# EAGLE design SparkFun_Digi_XBee_Arduino_Shield_Qwiic (EAGLE 9.6.2)
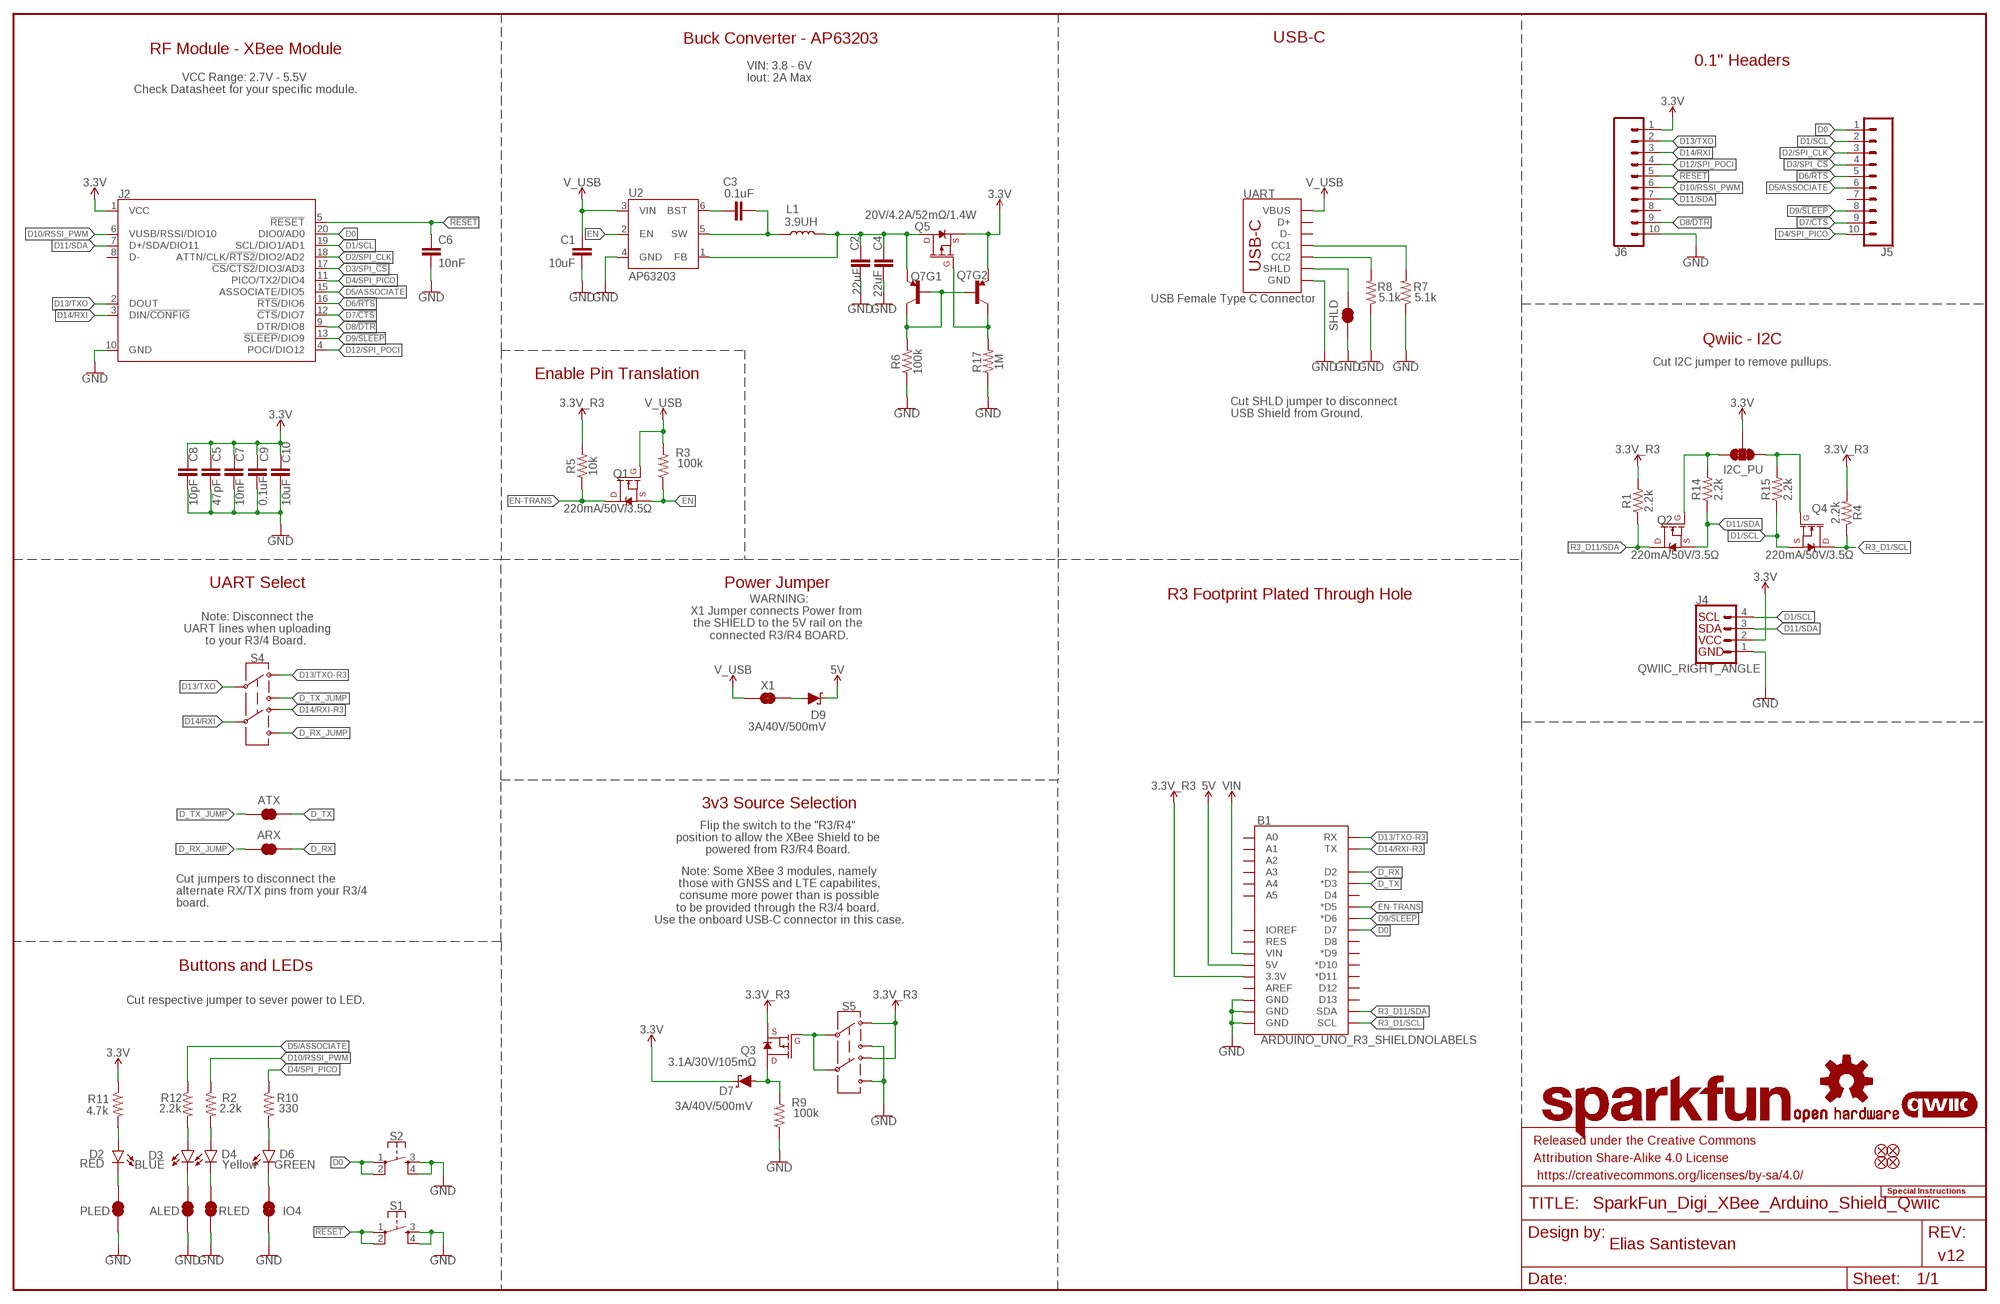
[diagram p0: schematic, sheet 1]

## Parts
ALED  JUMPER-SMT_2_NC_TRACE_SILK  [SMT-JUMPER_2_NC_TRACE_SILK]
ARX  JUMPER-SMT_2_NC_TRACE_SILK  [SMT-JUMPER_2_NC_TRACE_SILK]
ATX  JUMPER-SMT_2_NC_TRACE_SILK  [SMT-JUMPER_2_NC_TRACE_SILK]
B1  ARDUINO_UNO_R3_SHIELDNOLABELS  [UNO_R3_SHIELD_NOLABELS]
C1  10uF  10UF-1210-50V-20%  [1210]
C2  22uF  22UF-0603-6.3V-20%  [0603]
C3  0.1uF  0.1UF-0603-25V-5%  [0603]
C4  22uF  22UF-0603-6.3V-20%  [0603]
C5  47pF  47PF-0603-50V-5%  [0603]
C6  10nF  10NF-0603-50V-10%  [0603]
C7  10nF  10NF-0603-50V-10%  [0603]
C8  10pF  10PF-0603-50V-5%  [0603]
C9  0.1uF  0.1UF-0603-25V-(+80/-20%)  [0603]
C10  10uF  10UF-0603-6.3V-20%  [0603]
D2  RED  LED-RED_0603-KB  [LED-0603]
D3  BLUE  LED-BLUE0603  [LED-0603]
D4  Yellow  LED-YELLOW0603  [LED-0603]
D6  GREEN  LED-GREEN0603  [LED-0603]
D7  3A/40V/500mV  DIODE-SCHOTTKY-B340A  [SMA-DIODE]
D9  3A/40V/500mV  DIODE-SCHOTTKY-B340A  [SMA-DIODE]
FD1  FIDUCIAL1X2  [FIDUCIAL-1X2]
FD2  FIDUCIAL1X2  [FIDUCIAL-1X2]
FD3  FIDUCIAL1X2  [FIDUCIAL-1X2]
FD4  FIDUCIAL1X2  [FIDUCIAL-1X2]
FRAME1  FRAME-LEDGER  [CREATIVE_COMMONS]
I2C_PU  JUMPER-SMT_3_2-NC_TRACE_SILK  [SMT-JUMPER_3_2-NC_TRACE_SILK]
IO4  JUMPER-SMT_2_NC_TRACE_SILK  [SMT-JUMPER_2_NC_TRACE_SILK]
J2  XBEE_UPDATEXBEE_SMD  [XBEE3-SMD]
J4  QWIIC_RIGHT_ANGLE  QWIIC_CONNECTORJS-1MM  [JST04_1MM_RA]
J5  CONN_10NO_SILK_PTH_FEMALE  [1X10_NO_SILK]
J6  CONN_10NO_SILK_PTH_FEMALE  [1X10_NO_SILK]
L1  3.9UH  [INDUCTOR_3.9UH]
LOGO1  SFE_LOGO_NAMEBLANK  [BLANK]
LOGO2  OSHW-LOGOS  [OSHW-LOGO-S]
LOGO3  QWIIC_LOGO_4MM  [QWIIC_4MM]
LOGO4  SPECIAL_INSTRUCTIONS-ORDERING  [ORDERING_INSTRUCTIONS]
PLED  JUMPER-SMT_2_NC_TRACE_SILK  [SMT-JUMPER_2_NC_TRACE_SILK]
Q1  220mA/50V/3.5Ω  MOSFET-NCH-BSS138  [SOT23-3]
Q2  220mA/50V/3.5Ω  MOSFET-NCH-BSS138  [SOT23-3]
Q3  3.1A/30V/105mΩ  MOSFET_PCH-DMG2307L  [SOT23-3]
Q4  220mA/50V/3.5Ω  MOSFET-NCH-BSS138  [SOT23-3]
Q5  20V/4.2A/52mΩ/1.4W  MOSFET_PCH-DMG2305UX-7  [SOT23-3]
Q7  TRANS_PNP_DUALSOT-363  [SOT363_PHILIPS]
R1  2.2k  2.2KOHM-0603-1/10W-1%  [0603]
R2  2.2k  2.2KOHM-0603-1/10W-1%  [0603]
R3  100k  100KOHM-0603-1/10W-1%  [0603]
R4  2.2k  2.2KOHM-0603-1/10W-1%  [0603]
R5  10k  10KOHM-0603-1/10W-1%  [0603]
R6  100k  100KOHM-0603-1/10W-1%  [0603]
R7  5.1k  5.1KOHM5.1KOHM-0603-1/10W-1%  [0603]
R8  5.1k  5.1KOHM5.1KOHM-0603-1/10W-1%  [0603]
R9  100k  100KOHM-0603-1/10W-1%  [0603]
R10  330  330OHM-0603-1/10W-1%  [0603]
R11  4.7k  4.7KOHM-0603-1/10W-1%  [0603]
R12  2.2k  2.2KOHM-0603-1/10W-1%  [0603]
R14  2.2k  2.2KOHM-0603-1/10W-1%  [0603]
R15  2.2k  2.2KOHM-0603-1/10W-1%  [0603]
R17  1M  1MOHM-0603-1/4W-5%  [0603]
RLED  JUMPER-SMT_2_NC_TRACE_SILK  [SMT-JUMPER_2_NC_TRACE_SILK]
S1  MOMENTARY-SWITCH-SPST-2-SMD-5.2MM-TALL  [TACTILE_SWITCH_SMD_5.2MM]
S2  MOMENTARY-SWITCH-SPST-2-SMD-5.2MM-TALL  [TACTILE_SWITCH_SMD_5.2MM]
S4  SWITCH-DPDT-SMD-AYZ0202  [SWITCH_DPDT_SMD_AYZ0202]
S5  SWITCH-DPDT-SMD-AYZ0202  [SWITCH_DPDT_SMD_AYZ0202]
SHLD  JUMPER-SMT_2_NC_TRACE_SILK  [SMT-JUMPER_2_NC_TRACE_SILK]
U2  AP63203  [SOT23-6]
UART  USB Female Type C Connector  USB_C_4-LAYER-ISOLATED  [USB-C-16P-4LAYER-ISOLATED]
X1  JUMPER-SMT_2_NO_SILK  [SMT-JUMPER_2_NO_SILK]

## Nets
3.3V: C5.1 C7.1 C8.1 C9.1 C10.1 D7.C I2C_PU.2 J2.1(VCC) J4.2 J6.1 Q5.2(S) Q7.4(E) R11.1
3.3V_R3: B1.3.3V Q3.2(S) R1.2 R4.2 R5.2 S5.3 S5.6
3.3V_VREG: C2.1 C4.1 L1.P$2 Q5.3(D) Q7.1(E) U2.1(FB)
5V: B1.5V D9.C
!RESET!: C6.1 J2.5(!RESET!) J6.5 S1.1 S1.2
D0: B1.D7 J2.20(DIO0/AD0) J5.1 S2.1 S2.2
D1/SCL: J2.19(SCL/DIO1/AD1) J4.4 J5.2 Q4.2(S) R15.1
D2/SPI_CLK: J2.18(ATTN/CLK/!RTS2!/DIO2/AD2) J5.3
D3/SPI_!CS!: J2.17(!CS!/!CTS2!/DIO3/AD3) J5.4
D4/SPI_PICO: J2.11(PICO/TX2/DIO4) J5.10 R10.1
D5/ASSOCIATE: J2.15(ASSOCIATE/DIO5) J5.6 R12.1
D6/!RTS!: J2.16(!RTS!/DIO6) J5.5
D7/!CTS!: J2.12(!CTS!/DIO7) J5.9
D8/!DTR!: J2.9(DTR/DIO8) J6.9
D9/!SLEEP!: B1.D6(*D6) J2.13(!SLEEP!/DIO9) J5.8
D10/RSSI_PWM: J2.6(VUSB/RSSI/DIO10) J6.6 R2.1
D11/SDA: J2.7(D+/SDA/DIO11) J4.3 J6.7 Q2.2(S) R14.1
D12/SPI_POCI: J2.4(POCI/DIO12) J6.4
D13/TXO: J2.2(DOUT) J6.2 S4.2
D13/TXO-R3: B1.RX S4.3
D14/RXI: J2.3(DIN/!CONFIG!) J6.3 S4.5
D14/RXI-R3: B1.TX S4.6
D_RX: ARX.2 B1.D2
D_RX_JUMP: ARX.1 S4.4
D_TX: ATX.2 B1.D3(*D3)
D_TX_JUMP: ATX.1 S4.1
EN: Q1.2(S) R3.1 U2.2(EN)
EN-TRANS: B1.D5(*D5) Q1.3(D) R5.1
GND: ALED.1 B1.GND@0(GND) B1.GND@1(GND) B1.GND@2(GND) C1.2 C2.2 C4.2 C5.2 C6.2 C7.2 C8.2 C9.2 C10.2 IO4.1 J2.10(GND) J4.1 J6.10 PLED.1 R6.1 R7.1 R8.1 R9.1 R17.1 RLED.1 S1.3 S1.4 S2.3 S2.4 S5.1 S5.4 SHLD.1 U2.4(GND) UART.GND UART.GND2(GND)
N$1: C3.1 U2.6(BST)
N$2: D4.A R2.2
N$3: D4.C RLED.2
N$4: D6.A R10.2
N$5: R8.2 UART.B5(CC2)
N$6: R7.2 UART.A5(CC1)
N$7: D2.A R11.2
N$8: C3.2 L1.P$1 U2.5(SW)
N$9: D9.A X1.2
N$10: I2C_PU.1 Q4.1(G) R15.2
N$11: I2C_PU.3 Q2.1(G) R14.2
N$12: D3.A R12.2
N$16: D7.A Q3.3(D) R9.2
N$17: D6.C IO4.2
N$19: Q7.2(B) Q7.5(B) Q7.6(C) R6.2
N$20: Q5.1(G) Q7.3(C) R17.2
N$21: ALED.2 D3.C
N$23: D2.C PLED.2
N$27: Q3.1(G) S5.2 S5.5
R3_D1/SCL: B1.SCL Q4.3(D) R4.1
R3_D11/SDA: B1.SDA Q2.3(D) R1.1
SHLD: SHLD.2 UART.SHLD1(SHLD) UART.SHLD2(SHLD) UART.SHLD3(SHLD) UART.SHLD4(SHLD) UART.SHLD5(SHLD) UART.SHLD6(SHLD) UART.SHLD7(SHLD) UART.SHLD8(SHLD)
V_USB: C1.1 Q1.1(G) R3.2 U2.3(VIN) UART.VBUS1(VBUS) UART.VBUS2(VBUS) X1.1
VIN: B1.VIN
Unconnected: B1.A0 B1.A1 B1.A2 B1.A3 B1.A4 B1.A5 B1.AREF B1.D4 B1.D8 B1.D9(*D9) B1.D10(*D10) B1.D11(*D11) B1.D12 B1.D13 B1.IOREF B1.RES J2.8(D-) J5.7 J6.8 UART.A6(D+) UART.A7(D-) UART.B6(D+) UART.B7(D-)

## Notes on the sheet
- Buck Converter - AP63203 | USB-C
- RF Module - XBee Module
- 0.1" Headers
- VIN: 3.8 - 6V
  Iout: 2A Max
- VCC Range: 2.7V - 5.5V 
  Check Datasheet for your specific module.
- Qwiic - I2C
- Cut I2C jumper to remove pullups.
- Enable Pin Translation
- Cut SHLD jumper to disconnect
  USB Shield from Ground.
- UART Select | Power Jumper
- R3 Footprint Plated Through Hole
- WARNING:
  X1 Jumper connects Power from  
  the SHIELD to the 5V rail on the 
  connected R3/R4 BOARD.
- Note: Disconnect the
  UART lines when uploading
  to your R3/4 Board.
- 3v3 Source Selection
- Flip the switch to the "R3/R4" 
  position to allow the XBee Shield to be 
  powered from R3/R4 Board.
- Note: Some XBee 3 modules, namely
  those with GNSS and LTE capabilites,
  consume more power than is possible
  to be provided through the R3/4 board. 
  Use the onboard USB-C connector in this case.
- Cut jumpers to disconnect the  
  alternate RX/TX pins from your R3/4
  board.
- Buttons and LEDs
- Cut respective jumper to sever power to LED.
- Elias Santistevan
- v12

## Library data of the parts
ALED ARX ATX IO4 PLED RLED SHLD = SparkFun-Jumpers:JUMPER-SMT_2_NC_TRACE: Normally closed trace jumper This jumper has a trace between two pads so it's normally closed (NC). Use a razor knife to open the connection. For best results follow the IPC guidelines for cutting traces: Cutout at least 0.063 mm (0.005 in). Remove all loose material to clean up the cut area. Seal the cut with an approved epoxy. Reapply solder to reclose the connection.
B1 = SparkFun-Boards:ARDUINO_UNO_R3_SHIELD: Arduino R3 Shield Footprint Shield form compatible with the Arduino Uno R3. SparkFun Products: MG2639 Cellular Shield <https://www.sparkfun.com/products/13120> MIDI Shield <https://www.sparkfun.com/products/12898> R3 Stackable Headers Kit <https://www.sparkfun.com/products/11417>
C1 = SparkFun-Capacitors:10UF: 10.0µF ceramic capacitors A capacitor is a passive two-terminal electrical component used to store electrical energy temporarily in an electric field.; PROD_ID: CAP-09824
C2 C4 = SparkFun-Capacitors:22UF: 22µF ceramic capacitors A capacitor is a passive two-terminal electrical component used to store electrical energy temporarily in an electric field.; PROD_ID: CAP-14464
C3 = SparkFun-Capacitors:0.1UF: 0.1µF ceramic capacitors A capacitor is a passive two-terminal electrical component used to store electrical energy temporarily in an electric field.; PROD_ID: CAP-08604
C5 = SparkFun-Capacitors:47PF: 47pF ceramic capacitors A capacitor is a passive two-terminal electrical component used to store electrical energy temporarily in an electric field.; PROD_ID: CAP-08913
C6 C7 = SparkFun-Capacitors:10NF: 0.01uF/10nF/10,000pF ceramic capacitors A capacitor is a passive two-terminal electrical component used to store electrical energy temporarily in an electric field. CAP-09321; PROD_ID: CAP-00867
C8 = SparkFun-Capacitors:10PF: 10pF ceramic capacitors A capacitor is a passive two-terminal electrical component used to store electrical energy temporarily in an electric field.; PROD_ID: CAP-11812
C9 = SparkFun-Capacitors:0.1UF: 0.1µF ceramic capacitors A capacitor is a passive two-terminal electrical component used to store electrical energy temporarily in an electric field.; PROD_ID: CAP-00810
C10 = SparkFun-Capacitors:10UF: 10.0µF ceramic capacitors A capacitor is a passive two-terminal electrical component used to store electrical energy temporarily in an electric field.; PROD_ID: CAP-11015
D2 = SparkFun-LED:LED-RED: Red SMD LED Used in manufacturing of most products at SparkFun Packages: 0603 - KB - KingBright (DIO-17976) SMD 0603 package [Datasheet] <https://www.kingbrightusa.com/images/catalog/SPEC/APT1608SURCK.pdf> 0603 - (DIO-00819, has gone EOL) SMD 0603 package 0603 SMART - SMD 0603 SMART package ( more efficient and expensive)[Product Link] <http://www.osram-os.com/Graphics/XPic2/00077099_0.pdf> 1206 - SMD1206 package [Product Link] <https://www.sparkfun.com/datasheets/DevTools/LilyPad/Q150OVS4.pdff> SparkFun Products: Pro Mini 328 -5V <https://www.sparkfun.com/products/821> RedBoard <https://www.sparkfun.com/products/12757> IOIO-OTG <https://www.sparkfun.com/products/13613>; PROD_ID: DIO-17976
D3 = SparkFun-LED:LED-BLUE: Blue SMD LED Used in manufacturing of various products at SparkFun Packages: 0603 - SMD 0603 package [Product Link] <http://www.digikey.com/product-detail/en/SMLE12BC7TT86/511-1589-2-ND/1641808> 1206 - SMD1206 package [Product Link] <http://www.digikey.com/product-detail/en/lite-on-inc/LTST-C150TBKT/160-1643-1-ND/573584> SparkFun Products: ESP8266 Thing-Dev Board <https://www.sparkfun.com/products/13711> RedBoard <https://www.sparkfun.com/products/12757>; PROD_ID: DIO-08575
D4 = SparkFun-LED:LED-YELLOW: Yellow SMD LED Used in manufacturing several products at SparkFun. Packages: 0603 - SMD 0603 package[Product Link] <http://www.kingbrightusa.com/product.asp?catalog_name=LED&product_id=APT1608SYCK> 0603 -SMART - SMART SMD 0603 package (more efficient/more expensive) [Product Link] <http://www.osram-os.com/osram_os/en/products/product-catalog/led-light-emitting-diodes/smartled-0603/ly-l29k/index.jsp> LilyPad - SMD1206 package[Product Datasheet] <https://www.sparkfun.com/datasheets/DevTools/LilyPad/Q150YUS4.pdf> SparkFun Products: Blynk Board <https://www.sparkfun.com/products/13794> IOIO-OTG <https://www.sparkfun.com/products/13613> XBee Explorer Serial <https://www.sparkfun.com/products/13225>; PROD_ID: DIO-09003
D6 = SparkFun-LED:LED-GREEN: Green SMD LED Used in manufacturing of various products at SparkFun Packages: 0603 - SMD 0603 package [Product Link] <http://www.futureelectronics.com/en/technologies/semiconductors/optoelectronics/leds/Pages/9894312-LTST-C190GKT.aspx?CrossPart=HSMG-C190&IM=0> LilyPad 1206 - SMD1206 LilyPad package [Product Link] <http://www.futureelectronics.com/en/Technologies/Product.aspx?ProductID=IN150NGHARVATEKCORPORATION2049943&IM=0> 1206 - SMD1206 package [Product Link] <http://www.futureelectronics.com/en/technologies/semiconductors/optoelectronics/leds/Pages/8315665-LTST-C150KGKT.aspx?IM=0> 1206 Bottom Mount -SMD 1206 Bottom Mount [Product Link] <http://www.digikey.com/product-detail/en/lite-on-inc/LTST-C230KGKT/160-1456-1-ND/386854> SparkFun Products: Pro Mini 328 -5V <https://www.sparkfun.com/products/821> RedBoard <https://www.sparkfun.com/products/12757> MP3 Trigger <https://www.sparkfun.com/products/13720> Makey Makey <https://www.sparkfun.com/products/11076>; PROD_ID: DIO-00821
D7 D9 = SparkFun-DiscreteSemi:DIODE-SCHOTTKY: Schottky diode A Schottky diode is a semiconductor diode which has a low forward voltage drop and a very fast switching action.; PROD_ID: DIO-09886
FD1-FD4 = SparkFun-Aesthetics:FIDUCIAL: Fiducial Alignment Points Point-of-reference for pick-and-place machines and other optical instruments.
FRAME1 = SparkFun-Aesthetics:FRAME-LEDGER: Schematic Frame - Ledger Standard 11x14 US Ledger frame
I2C_PU = SparkFun-Jumpers:JUMPER-SMT_3_2-NC_TRACE: Normally closed trace jumper (2 of 2 connections) This jumper has a trace between all three pads so they are normally closed (NC). Use a razor knife to open the connection(s). For best results follow the IPC guidelines for cutting traces: Cutout at least 0.063 mm (0.005 in). Remove all loose material to clean up the cut area. Seal the cut with an approved epoxy. Reapply solder to reclose the connection(s).
J2 = xbee_smart_modem:XBEE_UPDATE: XBee 3 Cat 1 Smart Modem
J4 = SparkFun-Connectors:QWIIC_CONNECTOR: SparkFun I2C Standard Qwiic Connector An SMD 1mm pitch JST connector makes it easy and quick (get it? Qwiic?) to connect I2C devices to each other. The Qwiic system <http://www.sparkfun.com/qwiic> enables fast and solderless connection between popular platforms and various sensors and actuators. We carry 200mm <https://www.sparkfun.com/products/14204>, 100mm <https://www.sparkfun.com/products/14205>, 50mm <https://www.sparkfun.com/products/14206>, and breadboard friendly <https://www.sparkfun.com/products/14207> Qwiic cables. We also offer 10 pcs strips <https://www.sparkfun.com/products/14323> the SMD connectors.; PROD_ID: CONN-13694
J5 J6 = SparkFun-Connectors:CONN_10: Multi connection point. Often used as Generic Header-pin footprint for 0.1 inch spaced/style header connections On any of the 0.1 inch spaced packages, you can populate with these: Break Away Headers - Straight <https://www.sparkfun.com/products/116> (PRT-00116) Break Away Male Headers - Right Angle <https://www.sparkfun.com/products/553> (PRT-00553) Female Headers <https://www.sparkfun.com/products/115> (PRT-00115) Break Away Headers - Machine Pin <https://www.sparkfun.com/products/117> (PRT-00117) Break Away Female Headers - Swiss Machine Pin <https://www.sparkfun.com/products/743> (PRT-00743) Arduino Stackable Header - 10 Pin <https://www.sparkfun.com/products/11376> (PRT-11376) For SCREWTERMINALS and SPRING TERMINALS visit here: Screw Terimnals on SparkFun.com <https://www.sparkfun.com/search/results?term=Screw+Terminals> (5mm/3.5mm/2.54mm spacing) This device is also useful as a general connection point to wire up your design to another part of your project. Our various solder wires solder well into these plated through hole pads. Hook-Up Wire - Assortment (Stranded, 22 AWG) <https://www.sparkfun.com/products/11375> (PRT-11375) Hook-Up Wire - Assortment (Solid Core, 22 AWG) <https://www.sparkfun.com/products/11367> (PRT-11367) View the entire wire category on our website here <https://www.sparkfun.com/categories/141> Special notes: Molex polarized connector foot print use with SKU : PRT-08231 with associated crimp pins and housings. 1MM SMD Version SKU: PRT-10208 NOTES ON THE VARIANTS LOCK and LOCK_LONGPADS... This footprint was designed to help hold the alignment of a through-hole component (i.e. 6-pin header) while soldering it into place. You may notice that each hole has been shifted either up or down by 0.005 of an inch from it's more standard position (which is a perfectly straight line). This slight alteration caused the pins (the squares in the middle) to touch the edges of the holes. Because they are alternating, it causes a "brace" to hold the component in place. 0.005 has proven to be the perfect amount of "off-center" position when using our standard breakaway headers. Although looks a little odd when you look at the bare footprint, once you have a header in there, the alteration is very hard to notice. Also,if you push a header all the way into place, it is covered up entirely on the bottom side.
L1 = SparkFun-Coils:3.9UH: Würth's Electronik 3.9uH Inductor Characteristics 3.9uH 2.4A Current Rating 2.8A Saturation Inductance Frequency: 100kHzd AEC-Q200 Certified 5mm x 5mm Package 30% tolerance; PROD_ID: NDUC-18014
LOGO1 = SparkFun-Aesthetics:SFE_LOGO_NAME: SparkFun Font Logo This is the SparkFun name logo. The logo on the schematic will always be the same size; the package variant is the height of the flame part of the logo (or the height the flame would be, if it were drawn). Default layer for the logo on the board is tSilk.
LOGO2 = SparkFun-Aesthetics:OSHW-LOGO: Open-Source Hardware (OSHW) Logo This logo indicates the piece of hardware it is found on incorporates a OSHW license and/or adheres to the definition of open source hardware found here: http://freedomdefined.org/OSHW
LOGO3 = SparkFun-Aesthetics:QWIIC_LOGO: Qwiic Logos for placement on schematic and PCB. The 5.5mm silk logo is best for placing next to Qwiic connector.
LOGO4 = SparkFun-Aesthetics:SPECIAL_INSTRUCTIONS: Special Ordering/Production Instructions Alert Symbol for special PCB ordering instructions or unique production process warnings. Ordering Instructions Production Instructions Types of information that should be added to box: Copper weight Soldermask color Silk color PCB thickness Number of layers PCB Standard: 1.6mm FR4 1 oz copper immersion silver plating red soldermask white silkscreen Types of information that should be added to box: Special wash requirements Depaneling instructions Humidification Glue curing Default text settings: 0.07 inch 9% ratio 50% line distance
Q1 Q2 Q4 = SparkFun-DiscreteSemi:MOSFET-NCH: N-channel MOSFETs Voltage controlled devices that allow control of high current outputs. SparkFun Products: SparkFun OpenScale <https://www.sparkfun.com/products/13261> SparkFun Digital Sandbox <https://www.sparkfun.com/products/12651> SparkFun Monster Moto Shield <https://www.sparkfun.com/products/10182> SparkFun MOSFET Power Controller <https://www.sparkfun.com/products/11214>; PROD_ID: TRANS-00830
Q3 = SparkFun-DiscreteSemi:MOSFET_PCH: P-channel MOSFETs Voltage controlled devices that allow control of high current outputs. SparkFun Products: SparkFun ESP32 Thing <https://www.sparkfun.com/products/13907> SparkFun ESP8266 Thing <https://www.sparkfun.com/products/13231> SparkFun Pi Servo HAT V2 <https://www.sparkfun.com/products/15316> DMG2305UX-7 (20V/4.2A/SOT23-3); PROD_ID: TRANS-11308
Q5 = SparkFun-DiscreteSemi:MOSFET_PCH: P-channel MOSFETs Voltage controlled devices that allow control of high current outputs. SparkFun Products: SparkFun ESP32 Thing <https://www.sparkfun.com/products/13907> SparkFun ESP8266 Thing <https://www.sparkfun.com/products/13231> SparkFun Pi Servo HAT V2 <https://www.sparkfun.com/products/15316> DMG2305UX-7 (20V/4.2A/SOT23-3); PROD_ID: TRANS-14388
Q7 = SparkFun-DiscreteSemi:TRANS_PNP_DUAL: Dual PNP Transistors in Single Package The BCM857BS puts two PNP transistors in a single package. Bipolar (BJT) Transistor Array 2 PNP (Dual) 45V 100mA 100MHz 200mW Surface Mount SOT-363 Datasheet <https://www.diodes.com/assets/Datasheets/BCM857BS.pdf> SparkFun Products: SparkFun Pi Servo HAT V2 <https://www.sparkfun.com>; PROD_ID: TRANS-14386
R1 R2 R4 R12 R14 R15 = SparkFun-Resistors:2.2KOHM: 2.2kΩ resistor A resistor is a passive two-terminal electrical component that implements electrical resistance as a circuit element. Resistors act to reduce current flow, and, at the same time, act to lower voltage levels within circuits. - Wikipedia; PROD_ID: RES-08272
R3 R6 R9 = SparkFun-Resistors:100KOHM: 100kΩ resistor A resistor is a passive two-terminal electrical component that implements electrical resistance as a circuit element. Resistors act to reduce current flow, and, at the same time, act to lower voltage levels within circuits. - Wikipedia; PROD_ID: RES-07828
R5 = SparkFun-Resistors:10KOHM: 10kΩ resistor A resistor is a passive two-terminal electrical component that implements electrical resistance as a circuit element. Resistors act to reduce current flow, and, at the same time, act to lower voltage levels within circuits. - Wikipedia; PROD_ID: RES-00824
R7 R8 = SparkFun-Resistors:5.1KOHM; PROD_ID: RES-12083
R10 = SparkFun-Resistors:330OHM: 330Ω resistor A resistor is a passive two-terminal electrical component that implements electrical resistance as a circuit element. Resistors act to reduce current flow, and, at the same time, act to lower voltage levels within circuits. - Wikipedia; PROD_ID: RES-00818
R11 = SparkFun-Resistors:4.7KOHM: 4.7kΩ resistor A resistor is a passive two-terminal electrical component that implements electrical resistance as a circuit element. Resistors act to reduce current flow, and, at the same time, act to lower voltage levels within circuits. - Wikipedia; PROD_ID: RES-07857
R17 = SparkFun-Resistors:1MOHM: 1MΩ resistor A resistor is a passive two-terminal electrical component that implements electrical resistance as a circuit element. Resistors act to reduce current flow, and, at the same time, act to lower voltage levels within circuits. - Wikipedia; PROD_ID: RES-07868
S1 S2 = SparkFun-Switches:MOMENTARY-SWITCH-SPST-2: Momentary Switch (Pushbutton) - SPST - Two Circuits Normally-open (NO) SPST momentary switches (buttons, pushbuttons). Schematic symbol includes two switch circuits. Variants SMD-4.6MMX2.8MM - 4.60mm x 2.80mm Tactile Momentary Button Switch - Used on SparkFun Pro Micro - RP2040 <https://www.sparkfun.com/products/17717> SMD-5.2MM - Mini Pushbutton Switch - SMD <https://www.sparkfun.com/products/8720> - Used on Arduino Pro Mini <https://www.sparkfun.com/products/11114>; PROD_ID: SWCH-14139
S4 S5 = SparkFun-Switches:SWITCH-DPDT: Double-Pole, Double-Throw (DPDT) Switch Double-pole, double-throw switches. Variant Overview PTH-GPI-152-3013 Used on SparkFun Geiger Counter <https://www.sparkfun.com/products/11345> SMD-AY0202 Surface Mount DPDT Switch <https://www.sparkfun.com/products/597> (COM-00597) Used on e.g. LilyPad Arduino USB - ATmega32U4 Board <https://www.sparkfun.com/products/12049>; PROD_ID: SWCH-08179; SF_SKU: COM-00597
U2 = SparkFun-IC-Power:AP63203: Diodes Inc. AP63203 3.8V-32V input 3.3V Buck The AP63200/AP63201/AP63203/AP63205 is a 2A, synchronous buck converter with a wide input voltage range of 3.8V to 32V and fully integrates a 125mΩ high-side power MOSFET and a 68mΩ lowside power MOSFET to provide high-efficiency step-down DC/DC conversion; PROD_ID: VREG-15244
UART = SparkFun-Connectors:USB_C: USB Type C 16Pin Connector Super Speed pins not available on the 16-pin purely SMD connector so this part is best for USB 2.0 implementations. D1 and D2 are tied together enabling D+/- no matter which way the cable is plugged into the connector. The two channel configuration pins (CC1/2) are exposed. These are normally connected to ground via 5.1k resistors but can be reconfigured for high current/high power applications. **4-LAYER BOARD WARNING!!** If designing 4-layer board, make sure to select the variant _4-LAYER-ISOLATED. The linked footprint (USB-C-16-4LAYER-ISOLATED) includes some very necessary cutout polygons in the inner layers (2 and 15). This prevents the PTH mounting shield legs on the USB connector from electrically connecting any other polygons on the inner layers (usually VCC and GND).; PROD_ID: CONN-14122
X1 = SparkFun-Jumpers:JUMPER-SMT_2_NO: Normally open jumper This jumper has two pads in close proximity to each other. Apply solder to close the connection. Round pads are easier to solder for beginners, but are a lot larger. SparkFun Product that uses the round pads: SparkFun EL Sequencer <https://www.sparkfun.com/products/12781>

## Net classes
1 POWER: width 0.559 mm, drill 0.305 mm
2 Diff pairs: width 0.203 mm, drill 0.305 mm, clearance 0.152 mm

## Board
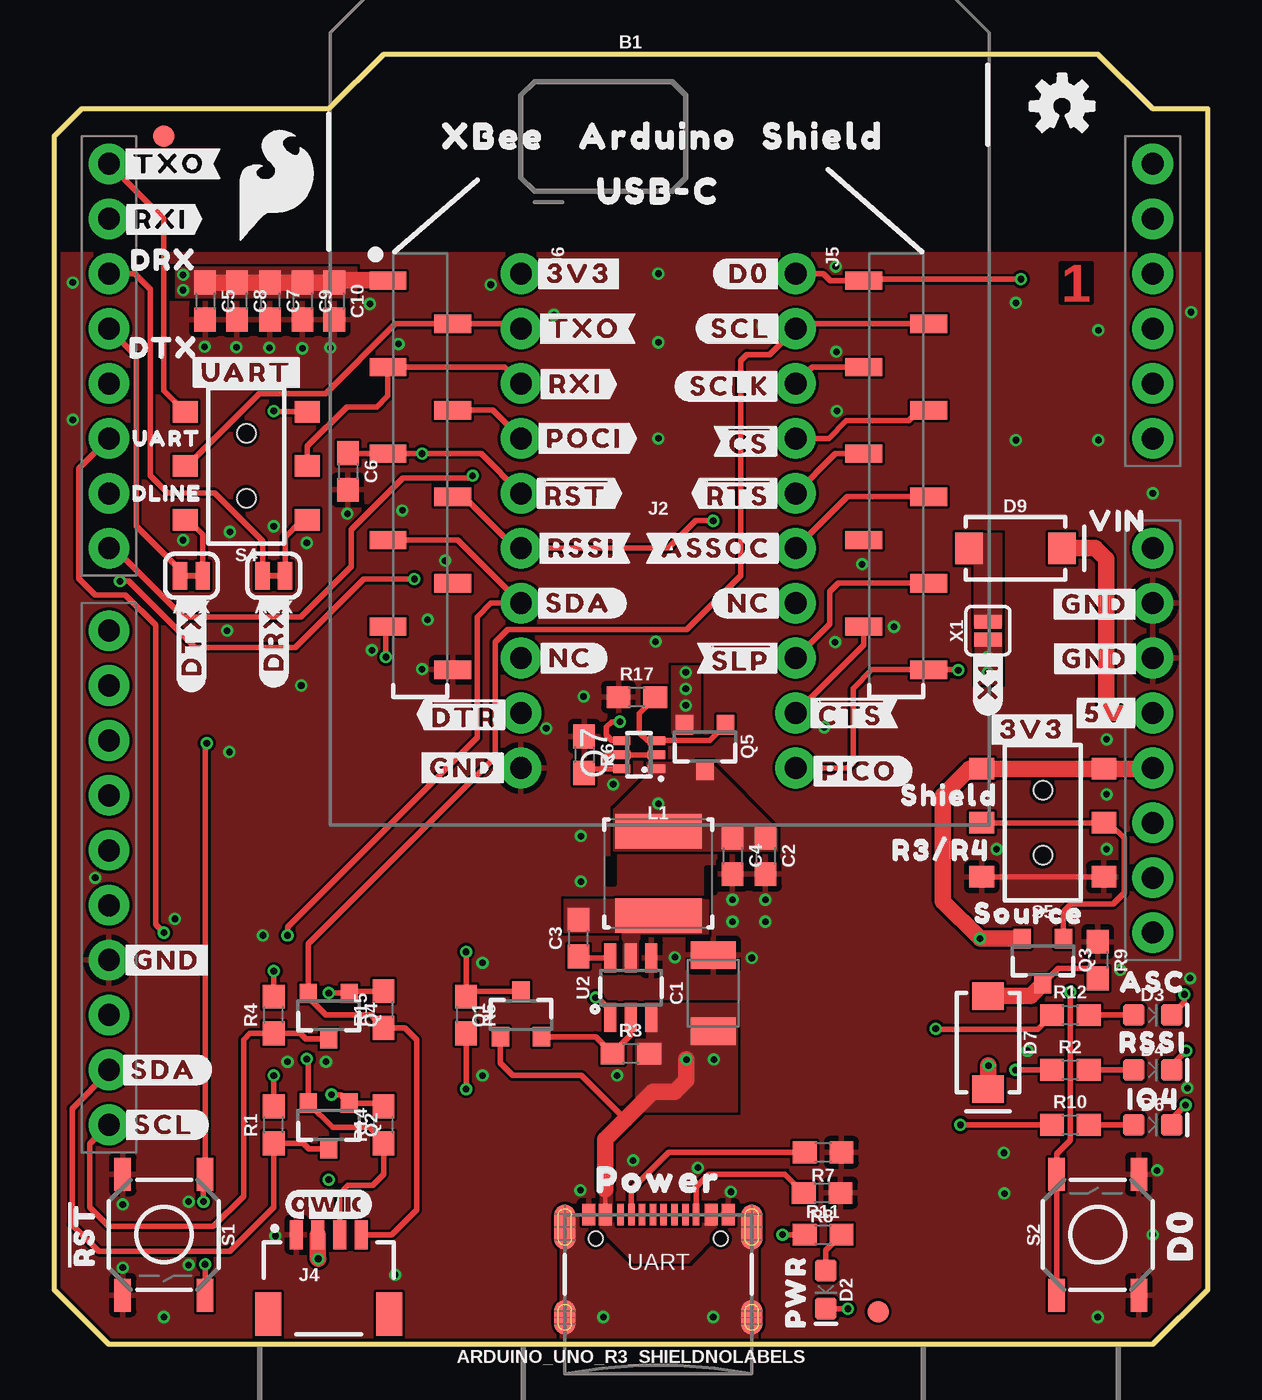
[diagram p1: board, top side]
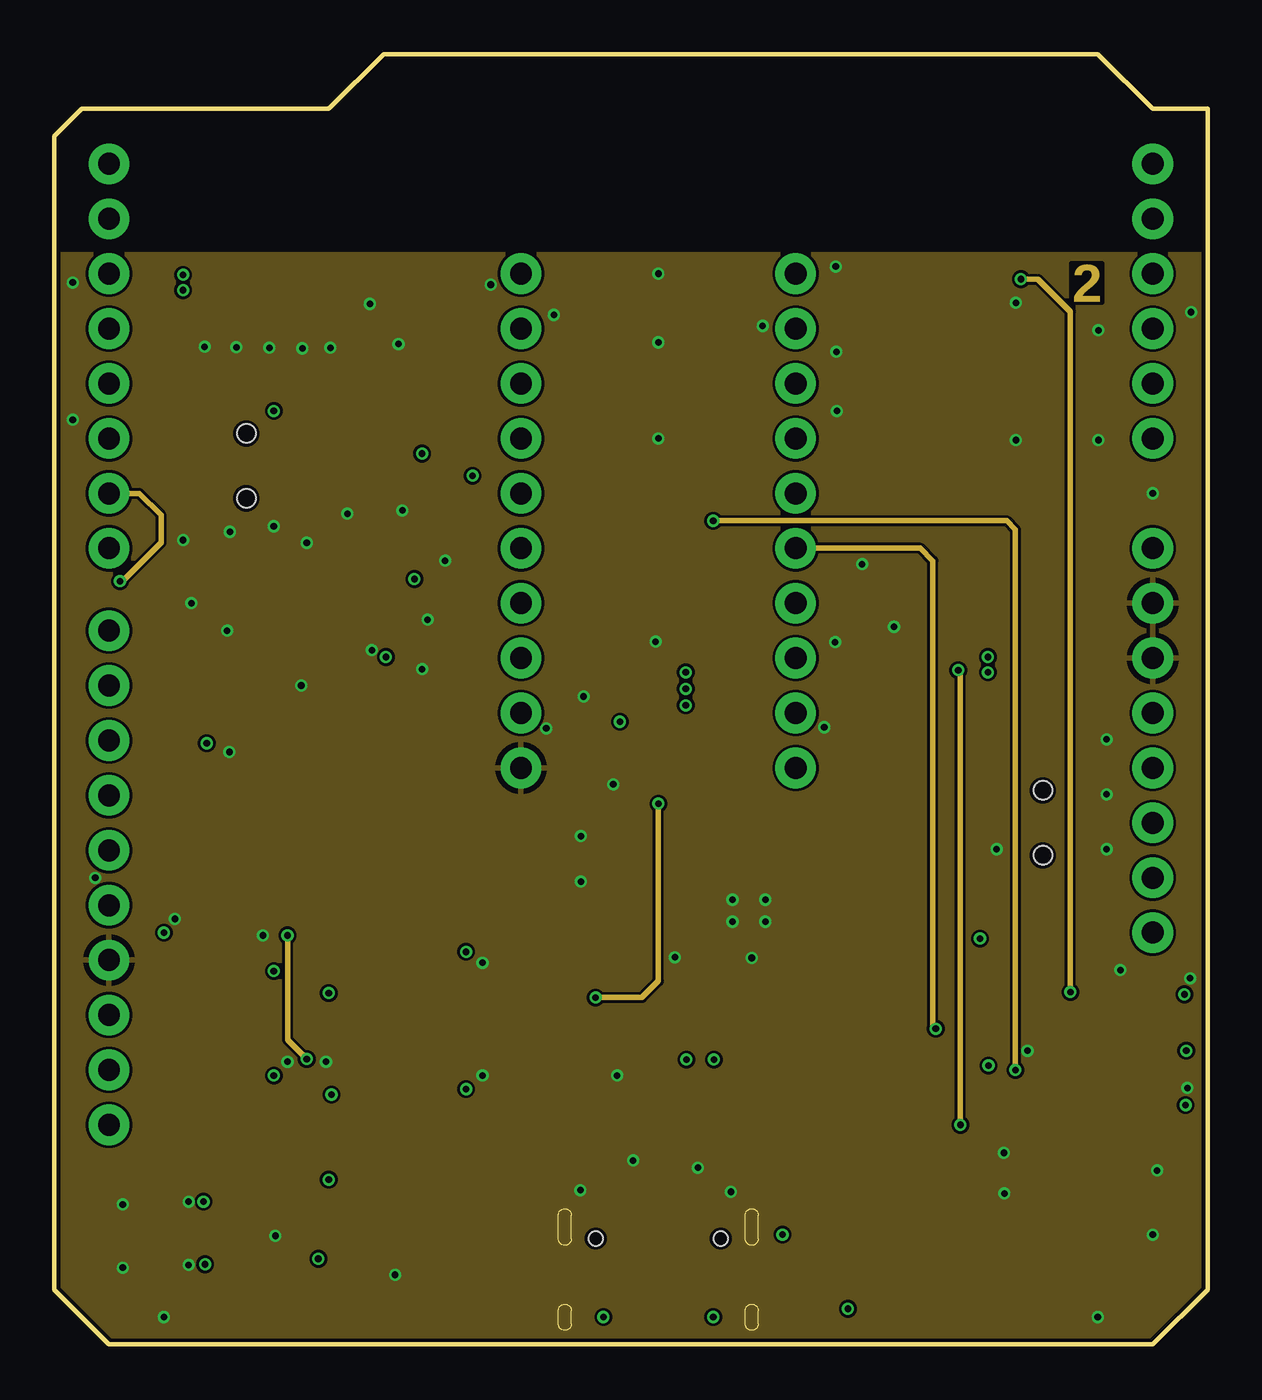
[diagram p2: board, inner layer Route2]
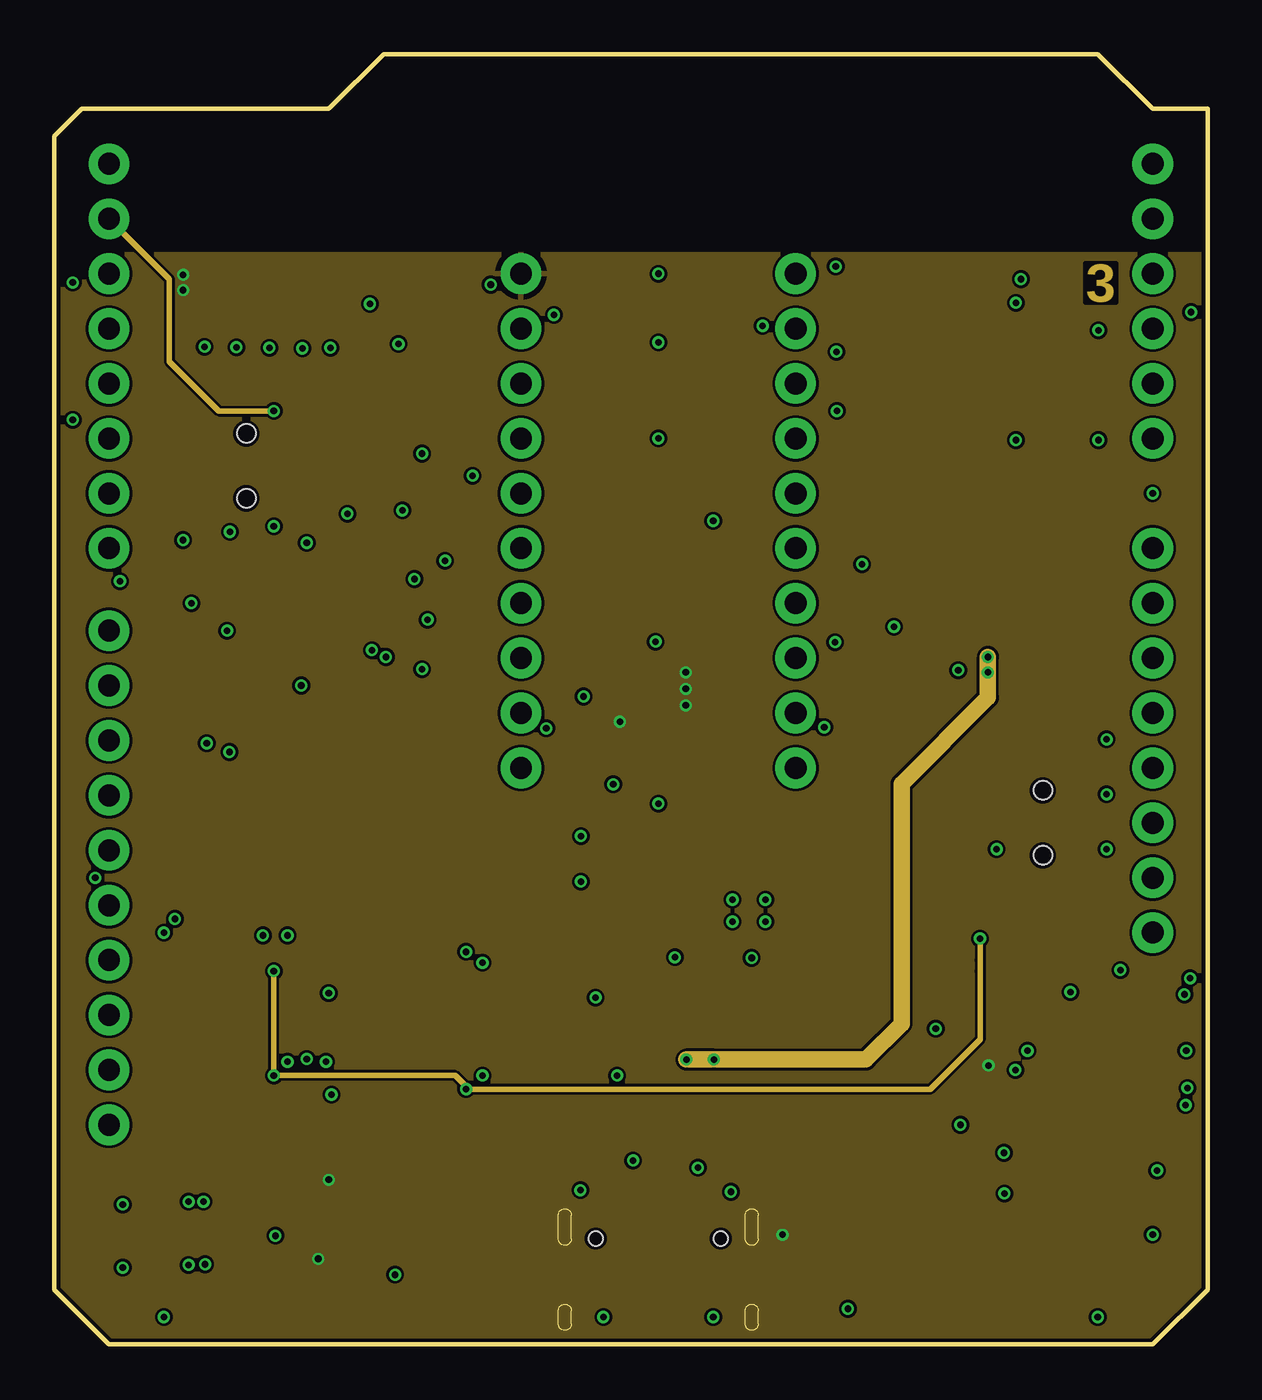
[diagram p3: board, inner layer Route15]
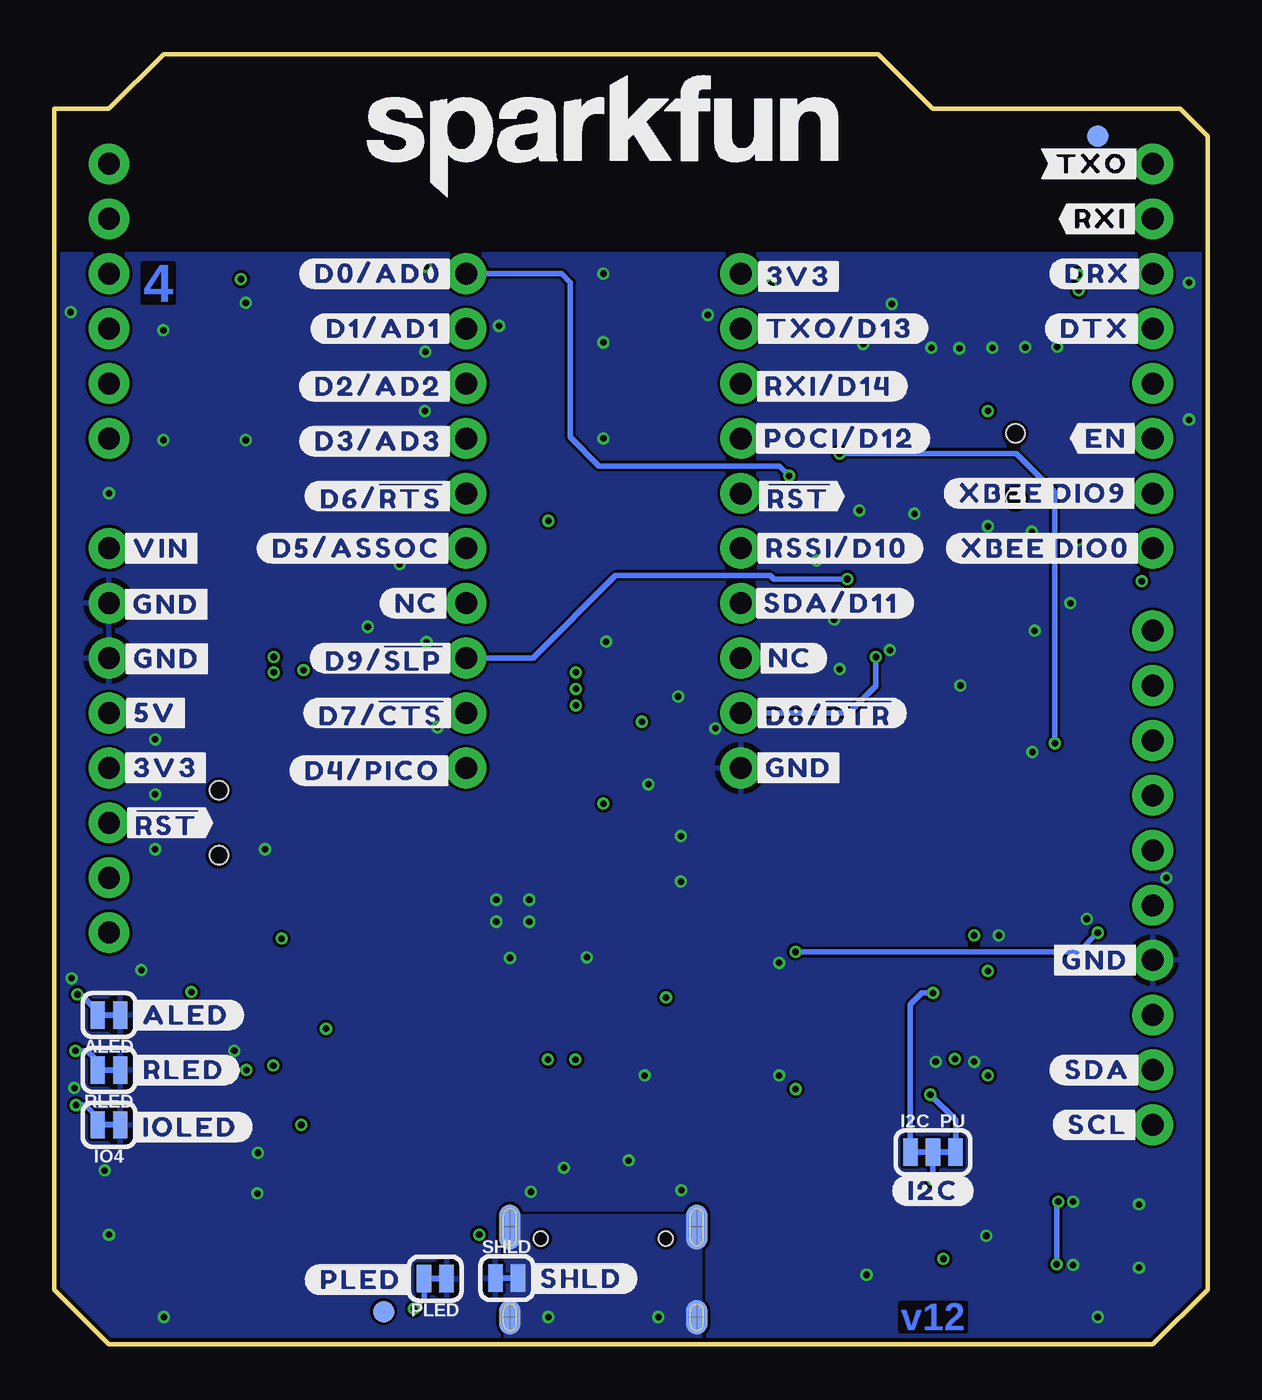
[diagram p4: board, bottom side, seen from below]

Size 53.34 x 59.69 mm. Coordinates in mm from the lower left corner, seen from the top.
Outline: 0,55.88 0,2.54 2.54,0 50.8,0 53.34,2.54 53.34,57.15 50.8,57.15 48.26,59.69 15.24,59.69 12.7,57.15 1.27,57.15 0,55.88
Copper layers (1*2*15*16): Top 0.035559375mm / dielectric 0.47751875mm / Route2 0.035559375mm / dielectric 0.47751875mm / Route15 0.035559375mm / dielectric 0.47751875mm / Bottom 0.035559375mm
Design rules "SparkFun-4-Layer-Minimum-JLCPCB": minimum track width 5mil, minimum drill 0.2mm, track to track 5mil, track to pad 5mil, pad to pad 5mil, via to via 5mil, smd to smd 5mil, copper to edge 7mil, drill to drill 7mil, minimum pad ring 5mil, minimum via ring 5mil, stop-mask expansion 2.5mil, vias tented up to drill 25mil, thermal gap 10mil
tRestrict: area 30.2,20.9 to 30.6,22; area 25.5,21.3 to 25.9,22.5

### Footprints (pad centres in the part's own frame; a part is rotated, then mirrored left to right if it is on the bottom)
SMT-JUMPER_2_NC_TRACE_SILK = smd 0.66 x 1.27: 1 -0.521,0; 2 0.521,0
UNO_R3_SHIELD_NOLABELS = drill 1.016 pad 1.88: 3.3V 24.13,-3.81; 5V 24.13,-1.27; A0 24.13,11.43; A1 24.13,13.97; A2 24.13,16.51; A3 24.13,19.05; A4 24.13,21.59; A5 24.13,24.13; AREF -24.13,-15.24; D2 -24.13,19.05; D3 -24.13,16.51; D4 -24.13,13.97; D5 -24.13,11.43; D6 -24.13,8.89; D7 -24.13,6.35; D8 -24.13,2.54; D9 -24.13,0; D10 -24.13,-2.54; D11 -24.13,-5.08; D12 -24.13,-7.62; D13 -24.13,-10.16; GND@0 24.13,1.27; GND@1 24.13,3.81; GND@2 -24.13,-12.7; IOREF 24.13,-8.89; NC 24.13,-11.43; RES 24.13,-6.35; RX -24.13,24.13; SCL -24.13,-20.32; SDA -24.13,-17.78; TX -24.13,21.59; VIN 24.13,6.35
1210 = smd 1.27 x 2.06: 1 -1.755,0; 2 1.755,0
0603 = smd 1.1 x 1: 1 -0.85,0; 2 0.85,0
LED-0603 = smd 1 x 1: A -0.877,0; C 0.877,0
SMA-DIODE = smd 1.27 x 1.47: A -2.15,0; C 2.15,0
FIDUCIAL-1X2 = smd 1 x 1: 1 0,0
SMT-JUMPER_3_2-NC_TRACE_SILK = smd 0.66 x 1.27: 1 -1.041,0; 2 0,0; 3 1.041,0
XBEE3-SMD = smd 1.7 x 0.85: 1 -12.5,11.11; 2 -9.5,9.11; 3 -12.5,7.11; 4 -9.5,5.11; 5 -12.5,3.11; 6 -9.5,1.11; 7 -12.5,-0.89; 8 -9.5,-2.89; 9 -12.5,-4.89; 10 -9.5,-6.89; 11 12.5,-6.89; 12 9.5,-4.89; 13 12.5,-2.89; 14 9.5,-0.89; 15 12.5,1.11; 16 9.5,3.11; 17 12.5,5.11; 18 9.5,7.11; 19 12.5,9.11; 20 9.5,11.11
JST04_1MM_RA = smd 0.6 x 1.35: 1 -1.5,0; 2 -0.5,0; 3 0.5,0; 4 1.5,0 | smd 1.2 x 2: NC1 2.8,-3.675; NC2 -2.8,-3.675
1X10_NO_SILK = drill 1.016 pad 1.88: 1 0,0; 2 2.54,0; 3 5.08,0; 4 7.62,0; 5 10.16,0; 6 12.7,0; 7 15.24,0; 8 17.78,0; 9 20.32,0; 10 22.86,0
INDUCTOR_3.9UH = smd 4 x 1.6: P$1 0,-2; P$2 0,1.9
SOT23-3 = smd 0.8 x 0.9: 1 -0.95,-1; 2 0.95,-1; 3 0,1.1
SOT363_PHILIPS = smd 0.4 x 0.8: 1 -0.65,-0.8; 2 0,-0.8; 3 0.65,-0.8; 4 0.65,0.8; 5 0,0.8; 6 -0.65,0.8
TACTILE_SWITCH_SMD_5.2MM = smd 1.524 x 0.762: 1 -2.794,1.905; 2 2.794,1.905; 3 -2.794,-1.905; 4 2.794,-1.905
SWITCH_DPDT_SMD_AYZ0202 = smd 1 x 1.15: 1 -2.5,2.825; 2 0,2.825; 3 2.5,2.825; 4 -2.5,-2.825; 5 0,-2.825; 6 2.5,-2.825 | hole 0.85: 1.5,0; -1.5,0
SOT23-6 = smd 0.55 x 1.35: 1 -0.95,-1.375; 2 0,-1.375; 3 0.95,-1.375; 4 0.95,1.375; 5 0,1.375; 6 -0.95,1.375
USB-C-16P-4LAYER-ISOLATED = smd 0.3 x 1: A5 -1.25,-0.34; A6 -0.25,-0.34; A7 0.25,-0.34; A8 1.25,-0.34; B5 1.75,-0.34; B6 0.75,-0.34; B7 -0.75,-0.34; B8 -1.75,-0.34 | smd 0.6 x 1: GND -3.225,-0.34; GND2 3.225,-0.34; VBUS1 -2.45,-0.34; VBUS2 2.45,-0.34 | smd 1 x 2.1: SHLD1 -4.32,-0.915; SHLD2 4.32,-0.915 | smd 1 x 2.1 bottom: SHLD3 -4.32,-0.915; SHLD4 4.32,-0.915 | smd 1 x 1.6: SHLD5 -4.32,-5.095; SHLD8 4.32,-5.095 | smd 1 x 1.6 bottom: SHLD6 -4.32,-5.095; SHLD7 4.32,-5.095 | hole 0.65: -2.89,-1.445; 2.89,-1.445
SMT-JUMPER_2_NO_SILK = smd 0.635 x 1.27: 1 -0.406,0; 2 0.406,0

### Placement (x,y rotation side)
ALED  50.8,15.24 180 bottom
ARX  10.16,35.56 180 top
ATX  6.35,35.56 180 top
B1  26.67,30.48 0 top
C1  30.48,16.26 90 top
C2  32.89,22.61 270 top
C3  24.26,18.8 90 top
C4  31.37,22.61 270 top
C5  6.99,48.26 270 top
C6  13.59,40.39 270 top
C7  9.98,48.26 270 top
C8  8.46,48.26 270 top
C9  11.48,48.26 270 top
C10  12.95,48.26 270 top
D2  35.69,2.54 270 top
D3  50.8,15.24 0 top
D4  50.8,12.7 0 top
D6  50.8,10.16 0 top
D7  43.18,13.97 270 top
D9  44.45,36.83 0 top
FD1  5.08,55.88 0 top
FD2  5.08,55.88 0 bottom
FD3  38.1,1.52 0 top
FD4  38.1,1.52 0 bottom
FRAME1  -10.16,-36.83 0 top  (outside the outline)
I2C_PU  12.7,8.89 0 bottom
IO4  50.8,10.16 180 bottom
J2  27.94,38.1 0 top
J4  12.7,5.08 0 top
J5  34.29,49.53 270 top
J6  21.59,49.53 270 top
L1  27.94,21.84 0 top
LOGO1  0,0 0 top
LOGO2  46.61,57.28 0 top
LOGO3  12.7,6.48 0 top
LOGO4  77.05,56.5 0 top  (outside the outline)
PLED  35.71,3.05 180 bottom
Q1  21.59,15.24 0 top
Q2  12.7,10.16 180 top
Q3  45.72,17.78 180 top
Q4  12.7,15.24 180 top
Q5  30.1,27.66 180 top
Q7  27.05,27.28 90 top
R1  10.16,10.16 90 top
R2  46.99,12.7 0 top
R3  26.67,13.46 0 top
R4  10.16,15.24 90 top
R5  19.05,15.24 270 top
R6  24.51,27.28 270 top
R7  35.56,8.89 180 top
R8  35.51,7.01 180 top
R9  48.26,17.78 270 top
R10  46.99,10.16 0 top
R11  35.56,5.08 0 top
R12  46.99,15.24 0 top
R14  15.24,10.16 90 top
R15  15.24,15.49 90 top
R17  26.95,29.95 0 top
RLED  50.8,12.7 180 bottom
S1  5.08,5.08 270 top
S2  48.26,5.08 90 top
S4  8.89,40.64 90 top
S5  45.72,24.13 90 top
SHLD  32.41,3.07 0 bottom
U2  26.67,16.51 0 top
U$1  [RSSI31]  50.8,13.97 0 top
U$2  [PWR29]  34.29,2.44 90 top
U$3  [#SDA#10]  5.08,12.7 0 top
U$4  [#SHLD#36]  28.96,3.05 0 bottom
U$5  [#NC#1]  19.3,31.75 0 bottom
U$6  [#D3#AD3#23]  38.35,41.78 0 bottom
U$7  [#NC#3]  36.58,34.29 0 bottom
U$8  [##DTR##27]  18.97,29.13 0 top
U$9  [#NC#1]  23.88,31.75 0 top
U$10  [#NC#3]  32.13,34.29 0 top
U$11  [#D1#AD1#8]  38.1,46.99 0 bottom
U$12  [##CTS##28]  36.83,29.21 0 top
U$13  [#D8##DTR##27]  17.53,29.21 0 bottom
U$14  [#RSSI#D10#17]  17.14,36.83 0 bottom
U$15  [#SDA#D11#9]  17.4,34.29 0 bottom
U$16  [##RST##15]  18.92,39.24 0 bottom
U$17  [#POCI#D12#24]  17.02,41.91 0 bottom
U$18  [#RXI#D14#15]  17.53,44.32 0 bottom
U$19  [#D2#AD2#19]  38.35,44.32 0 bottom
U$20  [#D6##RTS##25]  38.23,39.24 0 bottom
U$21  [#TXO#8]  24.51,46.99 0 top
U$22  [#TXO#D13#13]  17.02,46.99 0 bottom
U$23  [VIN5]  49.17,38.1 0 top
U$24  [#SCL#7]  5.08,10.16 0 top
U$25  [#GND#0]  5.21,17.78 0 top
U$26  [#I2C#33]  12.7,7.11 0 bottom
U$27  [#RXI#7]  24.1,44.42 0 top
U$28  [DRX52]  5.08,50.16 0 top
U$29  [#GND#0]  48.13,31.72 0 top
U$30  [#RST#30]  1.27,5.08 90 top
U$31  [#PICO#27]  37.24,26.52 0 top
U$32  [#TXO#8]  5.33,54.61 0 top
U$33  [#RXI#7]  4.93,52.04 0 top
U$34  [DTX53]  5.08,46.1 0 top
U$35  [#D5#ASSOC#25]  39.37,36.83 0 bottom
U$36  [#D9##SLP##28]  38.1,31.75 0 bottom
U$37  [#D7##CTS##26]  38.23,29.21 0 bottom
U$38  [#D4#PICO#25]  38.61,26.54 0 bottom
U$39  [#5V#5]  48.64,29.21 0 top
U$40  [D03]  52.07,5.08 90 top
U$41  [#GND#0]  48.11,34.24 0 top
U$42  [DLINE45]  5.21,39.37 0 top
U$43  [#X1#10]  43.18,30.68 90 top
U$44  [#3V3#1]  45.21,28.45 0 top
U$45  [#POCI#32]  24.51,41.91 0 top
U$46  [SHIELD55]  41.4,25.4 0 top
U$47  [#3V3#1]  24.26,49.53 0 top
U$48  [UART44]  5.21,41.91 0 top
U$49  [#ALED#21]  47.24,15.24 0 bottom
U$50  [#GND#0]  18.9,26.67 0 top
U$51  [#RLED#22]  47.35,12.7 0 bottom
U$52  [#PLED#20]  39.17,3 0 bottom
U$53  [#GND#0]  48.16,34.24 0 bottom
U$54  [##RST##13]  24.13,39.37 0 top
U$55  [#RSSI#16]  24.38,36.83 0 top
U$56  [#SDA#10]  24.26,34.29 0 top
U$57  [#ASSOC#28]  30.61,36.83 0 top
U$58  [##RTS##14]  31.62,39.37 0 top
U$59  [##CS##26]  32.13,41.78 0 top
U$60  [#SCLK#33]  31.24,44.32 0 top
U$61  [SFE_LOGO_FLAME_.2]  10.29,53.59 0 top
U$62  [SFE_LOGO_NAME_.2]  27.94,55.88 0 bottom
U$63  [#GND#0]  48.13,31.72 0 bottom
U$64  [#SCL#9]  31.75,46.99 0 top
U$65  [#D0#3]  32.13,49.53 0 top
U$66  [#5V#5]  48.64,29.21 0 bottom
U$67  [#SDA#9]  5.08,12.7 0 bottom
U$68  [##SLP##28]  31.75,31.75 0 top
U$69  [R3#R455]  41.02,22.86 0 top
U$70  [#SCL#13]  5.08,10.16 0 bottom
U$71  [#DRX#56]  10.16,32.64 90 top
U$72  [#DTX#57]  6.35,32.51 90 top
U$73  [#TXO#61]  5.33,54.61 0 bottom
U$74  [ASC32]  50.8,16.76 0 top
U$75  [POWER49]  27.94,7.62 0 top
U$76  [#GND#0]  18.92,26.67 0 bottom
U$77  [#3V3#1]  18.92,49.4 0 bottom
U$78  [#D0#AD0#18]  38.35,49.53 0 bottom
U$79  [ARDUINO1345]  27.94,55.88 0 top
U$80  [XBEE340]  20.32,55.88 0 top
U$81  [SHIELD1346]  35.56,55.88 0 top
U$82  [#GND#0]  5.21,17.78 0 bottom
U$83  [#EN#15]  4.7,41.91 0 bottom
U$84  [#3V3#1]  48.18,26.67 0 bottom
U$85  [#RXI#60]  4.95,52.07 0 bottom
U$86  [#DRX#56]  5.08,49.53 0 bottom
U$87  [##RST##13]  48.13,24.13 0 bottom
U$88  [#VIN#4]  48.39,36.83 0 bottom
U$89  [#DTX#57]  5.21,46.99 0 bottom
U$90  [#XBEE_DIO0#62]  7.49,36.83 0 bottom
U$91  [#UART#4048234]  8.89,44.96 0 top
U$92  [#XBEE_DIO9#62]  7.62,39.37 0 bottom
U$93  [#IOLED#5]  47.07,10.06 0 bottom
U$94  [IO49]  50.83,11.35 0 top
U$95  [SOURCE54]  45.09,19.94 0 top
U$96  [USB#C58]  27.94,53.34 0 top
UART  27.94,6.35 0 top
X1  43.18,33.02 90 top

### Tracks (layer width: path | path; a pad name or v marks a point on that pad's centre or on a via)
3.3V  (via drill 0.3)
  Top 0.254: R11.1 v33.68,5.08 | Q7.4 25.79,27.93 25.54,28.18 25.54,28.56 25.78,28.8 v26.16,28.8
  Top 0.762: J2.1 15.41,49.24 13.08,49.24 C10.1 C9.1 C7.1 8.66,49.11 8.56,49.21 C8.1 C5.1 | J4.2 12.2,3.98 v12.22,3.96 | v43.2,12.9 43.2,11.85 D7.C
  Bottom 0.254: I2C_PU.2 v12.7,7.62
  other vias: 5.97,49.48 5.97,48.77 29.21,29.57 29.21,30.33 29.21,31.09
  pour Route15 (isolate 0.127, rank 3): 0,0 53.34,0 53.34,50.42 0,50.42
  pour Top (no thermals): 13.97,49.81 5.64,49.81 5.64,48.44 13.97,48.44
  pour Top (no thermals): 28.57,28.3 29.84,28.3 29.84,31.37 28.57,31.37
3.3V_R3  (via drill 0.3)
  Top 0.254: R5.2 v19.05,11.81 | R4.2 v10.16,17.27 | R1.2 v10.16,12.45
  Top 0.762: B1.3.3V 50.76,26.63 S5.6 S5.3 42.33,26.63 41.1,25.4 41.1,20.5 v42.81,18.78 Q3.2
  Route15 0.254: v42.81,18.78 42.81,17.78 42.81,17.27 42.81,14.11 40.51,11.81 v19.05,11.81 19.05,11.94 18.54,12.45 v10.16,12.45 v10.16,17.27
3.3V_VREG  (via drill 0.3)
  Top 0.254: U2.1 25.72,15.45 25.12,16.05 v25.04,16.05
  Route2 0.254: v25.04,16.05 27.18,16.05 27.94,16.82 v27.94,25.02
  pour Top (no thermals): 25.91,24.74 25.91,22.86 33.43,22.86 33.43,23.83 30.35,26.9 27.43,26.9 27.43,26.26
5V
  Top 0.762: B1.5V 49.02,29.21 48.64,29.59 48.64,36.32 48.13,36.83 D9.C
!RESET!  (via drill 0.3)
  Top 0.254: J6.5 19.75,41.21 v17.02,41.21 J2.5 13.62,41.21 C6.1 | v6.91,6.6 6.91,7.8 S1.1 6.99,27.74 v7.06,27.81 | v6.99,3.71 S1.2
  Bottom 0.254: v17.02,41.21 8.85,41.21 7.06,39.42 v7.06,27.81 | v6.91,6.6 6.99,6.53 v6.99,3.71
D0  (via drill 0.3)
  Top 0.254: J5.1 35.56,49.53 35.88,49.21 J2.20 37.51,49.28 v44.7,49.28 | S2.1 S2.2 46.35,8.81 46.99,9.45 v46.99,16.3 v46.99,16.31 | v19.36,40.18 19.25,40.08 16.13,40.08 13.74,37.69 13.74,35.99 11.4,33.66 5.97,33.66 2.79,36.83 B1.D7
  Route2 0.254: v46.99,16.31 46.99,47.78 45.5,49.28 v44.7,49.28
  Bottom 0.254: v19.36,40.18 19.81,40.64 28.14,40.64 29.46,41.96 29.46,49.12 29.87,49.53 J5.1
D1/SCL
  Top 0.254: J2.19 34.51,47.21 J5.2 33.1,45.8 32.03,45.8 31.75,45.52 31.75,35.56 29.26,33.07 20.97,33.07 20.4,32.5 20.4,27.16 11.75,18.52 Q4.2 11.75,16.06 12.57,15.24 14.64,15.24 R15.1 16.22,14.64 16.76,14.1 16.76,6.22 15.62,5.08 J4.4
D2/SPI_CLK
  Top 0.254: J2.18 35.05,45.21 J5.3
D3/SPI_!CS!
  Top 0.254: J2.17 40.01,43.21 39.53,42.73 36.63,42.73 35.81,41.91 J5.4
D4/SPI_PICO  (via drill 0.3)
  Top 0.254: J5.10 36.7,26.67 36.96,26.92 36.96,30.35 37.81,31.21 J2.11 41.79,31.21 v41.81,31.19 | R10.1 v41.91,10.16
  Route2 0.254: v41.81,31.19 41.91,31.09 v41.91,10.16
D5/ASSOCIATE  (via drill 0.3)
  Top 0.254: J2.15 36.67,39.21 J5.6 | R12.1 45.48,14.58 40.79,14.58 v40.77,14.61
  Route2 0.254: v40.77,14.61 40.64,14.73 40.64,36.25 40.06,36.83 J5.6
D6/!RTS!
  Top 0.254: J2.16 36.13,41.21 J5.5
D7/!CTS!
  Top 0.254: J2.12 37.44,32.36 J5.9
D8/!DTR!  (via drill 0.3)
  Top 0.254: J2.9 15.34,33.11 v15.34,31.8
  Bottom 0.254: J6.9 16.59,29.21 15.34,30.45 v15.34,31.8
D9/!SLEEP!  (via drill 0.3)
  Top 0.254: J5.8 35.87,33.33 35.87,34.82 36.25,35.21 J2.13 | v16.66,35.41 14.33,35.41 11.15,32.24 6.53,32.24 3.46,35.31 v3.05,35.31
  Route2 0.254: B1.D6 3.94,39.37 4.95,38.35 4.95,37.08 3.17,35.31 v3.05,35.31
  Bottom 0.254: v16.66,35.41 20.07,35.41 20.23,35.56 27.38,35.56 31.19,31.75 J5.8
D10/RSSI_PWM  (via drill 0.3)
  Top 0.254: J2.6 18.95,39.21 21.33,36.83 J6.6 28.4,36.83 29.67,38.1 v30.48,38.1 | R2.1 v44.45,12.7
  Route2 0.254: v30.48,38.1 44.04,38.1 44.45,37.69 v44.45,12.7
D11/SDA  (via drill 0.3)
  Top 0.254: J2.7 18.67,37.21 J6.7 20.19,34.29 19.56,33.66 19.56,28.07 10.79,19.3 v10.79,18.92 | v11.68,13.21 11.75,13.14 Q2.2 12.88,10.03 14.61,10.03 15.24,9.4 R14.1 15.24,7.87 14.73,7.37 13.59,7.37 13.2,6.98 J4.3
  Route2 0.254: v11.68,13.21 10.79,14.1 v10.79,18.92
D12/SPI_POCI
  Top 0.254: J6.4 20.29,43.21 J2.4
D13/TXO
  Top 0.254: J6.2 21.37,47.21 J2.2 15.79,47.21 12.56,43.98 9.48,43.98 6.14,40.64 S4.2
D13/TXO-R3
  Top 0.254: B1.RX 5.08,52.07 5.08,44.12 S4.3
D14/RXI
  Top 0.254: J6.3 20.83,45.21 J2.3 15.44,43.89 14.92,43.37 13.53,43.37 11.71,41.56 S4.5
D14/RXI-R3  (via drill 0.3)
  Top 0.254: S4.6 10.2,43.14 v10.16,43.18
  Route15 0.254: B1.TX 5.33,49.28 5.33,45.47 7.62,43.18 v10.16,43.18
D_RX
  Top 0.254: B1.D2 3.72,49.53 4.45,48.8 4.45,40.19 5.26,39.38 7.43,39.38 9.64,37.17 ARX.2
D_RX_JUMP
  Top 0.254: ARX.1 10.68,37.35 11.43,38.1 11.68,38.1 S4.4
D_TX
  Top 0.254: B1.D3 3.81,45.72 3.81,37.85 5.83,35.83 ATX.2
D_TX_JUMP
  Top 0.254: ATX.1 6.87,37.45 6.18,38.14 S4.1
EN
  Top 0.254: U2.2 26.67,14.31 R3.1 25.04,14.24 Q1.2
EN-TRANS  (via drill 0.3)
  Top 0.254: v5.08,19.05 4.7,19.43 4.7,33.27 3.3,34.67 1.91,34.67 1.14,35.43 1.14,40.51 B1.D5 | R5.1 19.05,16.13 | 19.05,16.13 v19.05,18.16 | Q1.3 19.26,16.34 19.05,16.13
  Bottom 0.254: v19.05,18.16 5.97,18.16 v5.08,19.05
GND  (via drill 0.3)
  Top 0.254: S5.4 S5.1
  other vias: 31.37,19.56 32.89,19.56 17.02,31.24 28.7,17.91 8.43,46.13 9.96,46.1 11.48,46.08 15.77,3.23 10.24,5.03 15.93,46.28 27.94,49.53 48.26,1.27 5.08,1.27 3.17,3.56 50.8,5.08 6.96,46.15 31.37,20.57 32.89,20.57 12.78,46.1 18.08,36.26 51,8.05 24.36,21.41 20.19,49.02 36.2,43.18 37.36,36.09 38.84,33.2 8.13,37.59 27.94,46.35 50.8,39.37 23.11,47.62 17.27,33.53 14.7,32.12 14.61,48.13 36.12,32.49 36.14,49.86 24.33,7.14 22.76,28.5 35.61,28.55 3.17,6.48 6.22,6.6 6.22,3.68 31.29,7.06 29.77,8.18 43.92,8.86 43.94,6.99 32.26,17.88 24.49,29.97 48.67,25.45 25.86,25.91 32.77,47.12 36.17,45.92 13.56,38.43 24.36,23.52 8.1,27.41 16.1,38.58 48.67,22.91 43.59,22.91 26.77,8.51 1.91,21.59 0.86,49.12 0.86,42.77 52.58,47.75 27.94,41.91 27.81,32.51 48.67,27.99 49.3,17.32 45.01,13.59 52.4,11.86 52.53,16.94 44.48,48.18 44.48,41.83 48.29,41.83 48.29,46.91 11.43,30.48 11.68,37.08 10.16,37.85 5.97,37.21 6.35,34.29 8,33.02 5.59,19.68 9.65,18.92 10.79,13.08 12.57,13.08 19.81,12.45 19.81,17.65 26.04,12.45
  pour Top (isolate 0.127, rank 3): 0,0 53.34,0 53.34,50.42 0,50.42
  pour Bottom (isolate 0.127, rank 3): 0,0 53.34,0 53.34,50.42 0,50.42
  pour Route2 (isolate 0.127, rank 3): 0,0 53.34,0 53.34,50.42 0,50.42
N$1
  Top 0.254: U2.6 24.45,17.89 24.39,17.95 C3.1
N$2
  Top 0.254: R2.2 49.23,12.7 D4.A
N$3  (via drill 0.3)
  Top 0.254: D4.C 51.68,12.92 v52.35,13.59
  Bottom 0.254: v52.35,13.59 51.82,13.59 51.32,13.09 RLED.2
N$4
  Top 0.254: R10.2 D6.A
N$5
  Top 0.254: UART.B5 29.69,7.29 30.28,7.87 33.8,7.87 R8.2
N$6
  Top 0.254: UART.A5 26.69,7.15 28.43,8.89 R7.2
N$7
  Top 0.254: D2.A 35.69,4.36 R11.2
N$8
  pour Top (isolate 0.305, no thermals): 27.05,17.27 27.05,19.02 30.23,19.02 30.23,20.57 23.62,20.57 23.62,19.08 26.29,19.08 26.29,17.27
N$9
  pour Top (no thermals): 42.57,33.27 43.79,33.27 43.79,37.49 41.71,37.49 41.71,36.12 42.57,36.12
N$10  (via drill 0.3)
  Top 0.254: R15.2 13.75,16.34 Q4.1 13.63,16.26 v12.7,16.26
  Bottom 0.254: I2C_PU.1 13.74,15.72 13.21,16.26 v12.7,16.26
N$11  (via drill 0.3)
  Top 0.254: R14.2 15.09,11.16 Q2.1 13.25,11.56 v12.83,11.56
  Bottom 0.254: I2C_PU.3 11.66,10.39 v12.83,11.56
N$12
  Top 0.254: D3.A 48.69,15.24 | 48.69,15.24 | R12.2 48.69,15.24 | 48.69,15.24
N$16
  Top 0.254: Q3.3 46.44,17.4 47.79,17.4 R9.2
  Top 0.762: Q3.3 45.16,16.12 D7.A
N$17  (via drill 0.3)
  Top 0.254: D6.C 51.68,10.43 v52.32,11.07
  Bottom 0.254: IO4.2 51.32,10.49 51.91,11.07 v52.32,11.07
N$19
  Top 0.254: Q7.6 25.4,26.63 | 25.4,26.63 24.71,26.63 R6.2 | 25.4,26.63 25.4,27.15 25.53,27.28 Q7.5 Q7.2
N$20
  Top 0.254: Q5.1 30.32,27.93 28.7,27.93 28.69,27.93 Q7.3 27.42,27.93 27.05,28.3 27.05,29.2 R17.2
N$21  (via drill 0.3)
  Top 0.254: v52.26,16.19 52.26,15.82 D3.C
  Bottom 0.254: v52.26,16.19 52.09,16.19 51.32,15.42 ALED.2
N$23  (via drill 0.3)
  Top 0.254: D2.C v36.7,1.65
  Bottom 0.254: PLED.2 36.23,2.12 v36.7,1.65
N$27
  Top 0.254: S5.2 S5.5 48.77,24.13 49.48,23.42 49.48,20.88 48.97,20.37 47.04,20.37 46.67,20 Q3.1
R3_D1/SCL
  Top 0.254: Q4.3 11.64,14.14 11.39,14.39 R4.1 9.06,14.39 8.76,14.1 8.76,6.86 7.37,5.46 2.54,5.46 1.65,6.35 1.65,9.27 B1.SCL
R3_D11/SDA
  Top 0.254: Q2.3 11.77,9.06 11.52,9.31 R1.1 10.16,6.35 8.13,4.32 2.06,4.32 0.84,5.54 0.84,10.91 2.54,12.61 B1.SDA
SHLD  (via drill 0.3)
  other vias: 25.4,1.27 30.48,1.27
  pour Top (rank 2, no thermals): 23.42,5.97 32.51,5.97 32.51,0 23.42,0
  pour Bottom (rank 2, no thermals): 32.51,5.97 23.42,5.97 23.42,0 32.51,0
V_USB  (via drill 0.3)
  Top 0.203: 25.49,7.19 UART.VBUS1
  Top 0.254: Q1.1 20.64,13.02 21.21,12.45 24.38,12.45 26.41,10.42
  Top 0.762: 25.49,7.19 25.49,9.49 26.41,10.42 27.68,11.68 28.7,11.68 29.23,12.22 v29.23,13.18
  Route15 0.762: v30.5,13.18 v29.23,13.18 37.54,13.18 39.19,14.84 39.19,25.93 43.18,29.92 v43.18,31.8
  other vias: 43.18,31.09
  pour Top (no thermals): 26.92,10.79 31.57,10.79 31.57,15.75 27.43,15.75 27.43,14.1 26.92,14.1
  pour Top (no thermals): 42.62,32.82 43.79,32.82 43.79,30.58 42.62,30.58
  pour Top (no thermals): 25.27,7.37 25.27,5.33 26.8,3.81 29.34,3.81 30.61,5.08 30.61,6.48 30.23,6.48 30.23,5.71 30.1,5.59 25.78,5.59 25.78,7.37

### Text on the board
Top: 1
Route2: 2
Route15: 3
Bottom: 4 | v12
Measures: Units in Inches
tDocu: Four Layer Board / 1 oz Outer Layer / 0.5 oz Inner Layer / JLC7628 Stackup / Lead-Free HASL / 1.6mm Thickness / Red Soldermask / White Silkscreen / Material: TG135-140 | Elias Santistevan